# EAGLE design dcv moduler incomplete (EAGLE 9.6.2)
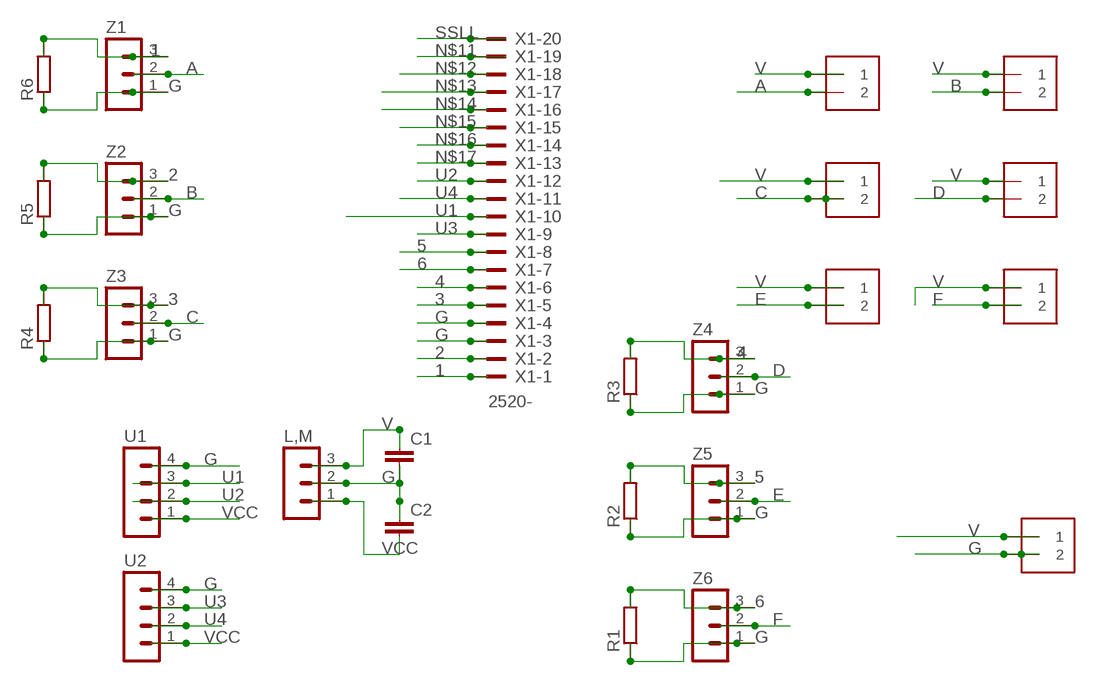
[diagram p0: schematic, sheet 1]

## Parts
C1  C2,5-3  [C2.5-3]
C2  C2,5-3  [C2.5-3]
J1  1X2-3.5MM  [1X2-3.5MM]
J2  1X2-3.5MM  [1X2-3.5MM]
J3  1X2-3.5MM  [1X2-3.5MM]
J4  1X2-3.5MM  [1X2-3.5MM]
J5  1X2-3.5MM  [1X2-3.5MM]
J6  1X2-3.5MM  [1X2-3.5MM]
J7  1X2-3.5MM  [1X2-3.5MM]
L,M  MA03-1  [MA03-1]
R1  R-EU_0204_5  [0204/5]
R2  R-EU_0204_5  [0204/5]
R3  R-EU_0204_5  [0204/5]
R4  R-EU_0204_5  [0204/5]
R5  R-EU_0204_5  [0204/5]
R6  R-EU_0204_5  [0204/5]
U1  MA04-1  [MA04-1]
U2  MA04-1  [MA04-1]
X1  2520-  [PAK100/2500-20]
Z1  MA03-1  [MA03-1]
Z2  MA03-1  [MA03-1]
Z3  MA03-1  [MA03-1]
Z4  MA03-1  [MA03-1]
Z5  MA03-1  [MA03-1]
Z6  MA03-1  [MA03-1]

## Nets
1: R6.2 X1.1 Z1.3
2: R5.2 X1.2 Z2.3
3: R4.2 X1.5 Z3.3
4: R3.2 X1.6 Z4.3
5: R2.2 X1.8 Z5.3
6: R1.2 X1.7 Z6.3
A: J1.2 Z1.2
B: J2.2 Z2.2
C: J3.2 Z3.2
D: J4.2 Z4.2
E: J5.2 Z5.2
F: J6.2 Z6.2
G: C1.2 C2.1 J7.2 L,M.2 R1.1 R2.1 R3.1 R4.1 R5.1 R6.1 U1.4 U2.4 X1.3 X1.4 Z1.1 Z2.1 Z3.1 Z4.1 Z5.1 Z6.1
N$11: X1.19
N$12: X1.18
N$13: X1.17
N$14: X1.16
N$15: X1.15
N$16: X1.14
N$17: X1.13
SSLL: X1.20
U1: U1.3 X1.10
U2: U1.2 X1.12
U3: U2.3 X1.9
U4: U2.2 X1.11
V: C1.1 J1.1 J2.1 J3.1 J4.1 J5.1 J6.1 J7.1 L,M.3
VCC: C2.2 L,M.1 U1.1 U2.1

## Library data of the parts
C1 C2 = capacitor-wima:C: CAPACITOR naming: grid - package width
J1-J7 = adafruit:1X2: 3.5mm Terminal block http://www.ladyada.net/library/pcb/eaglelibrary.html
L,M Z1-Z6 = con-lstb:MA03-1: PIN HEADER; OC_FARNELL: unknown; OC_NEWARK: unknown
R1-R6 = resistor (2):R-EU_: RESISTOR, European symbol; SPICEPREFIX: R
U1 U2 = con-lstb:MA04-1: PIN HEADER; OC_FARNELL: unknown; OC_NEWARK: unknown
X1 = con-3m:2520-: 3M (TM) Pak 100 4-Wall Header Source: 3M; OC_FARNELL: unknown; OC_NEWARK: unknown

## Board
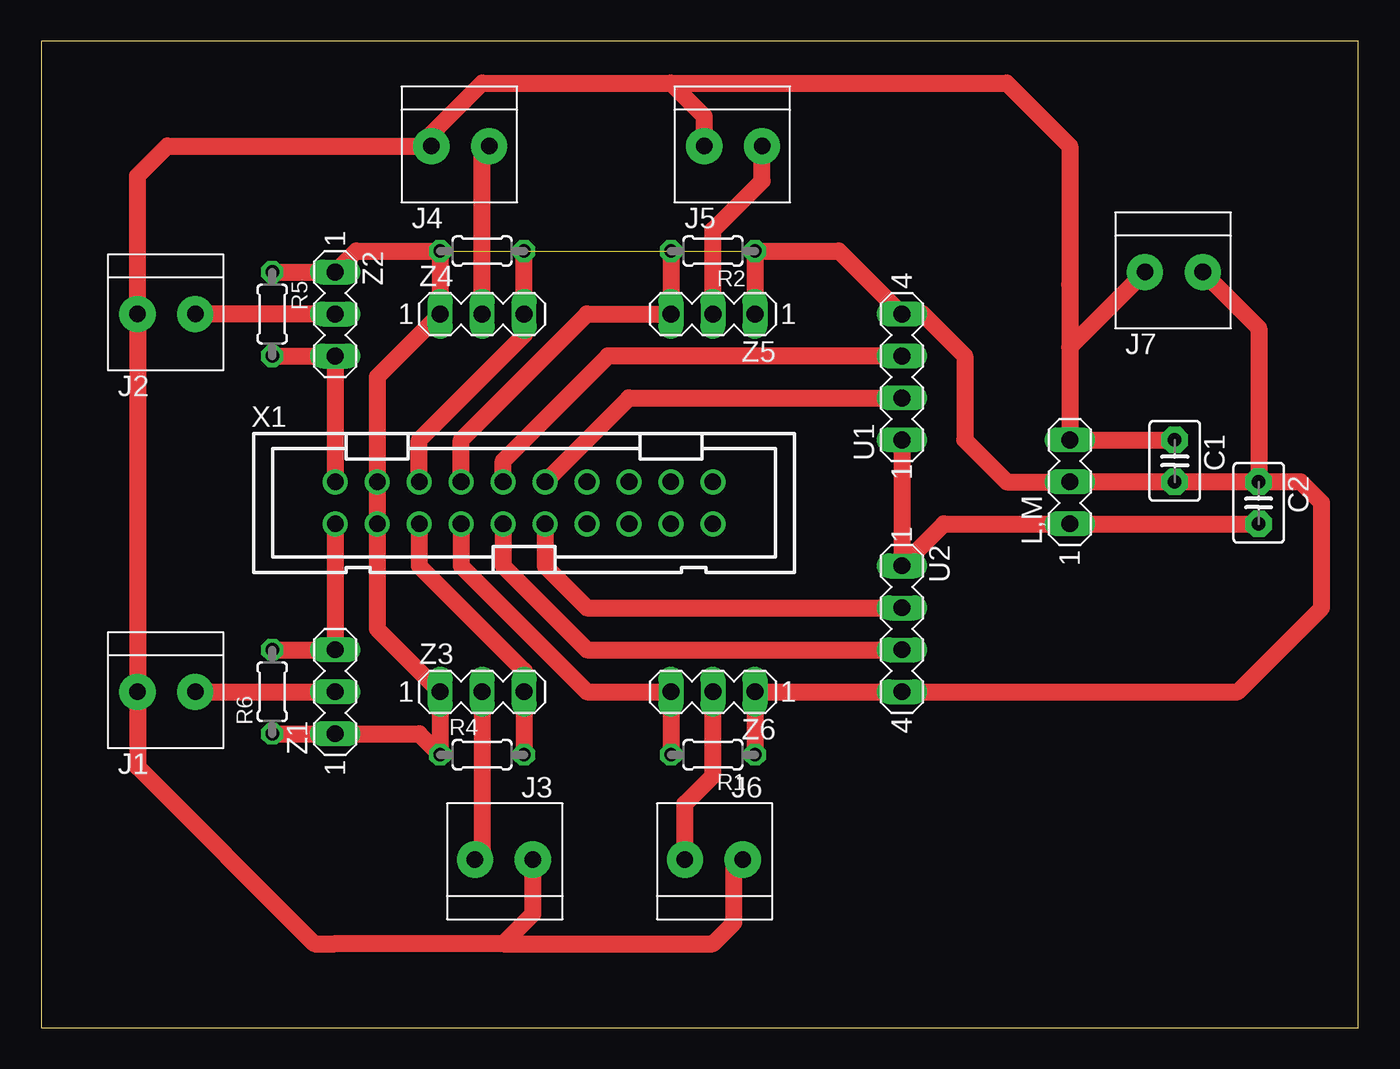
[diagram p1: board, top side]

Size 79.68 x 59.68 mm. Coordinates in mm from the lower left corner, seen from the top.
Outline: 0,0 79.68,0 79.68,59.68 0,59.68 0,0
Copper layers (1*16): Top 0.035mm / dielectric 1.5mm / Bottom 0.035mm
Design rules "default": minimum track width 6mil, minimum drill 0.35mm, track to track 6mil, track to pad 6mil, pad to pad 6mil, via to via 6mil, smd to smd 6mil, copper to edge 40mil, drill to drill 6mil, minimum pad ring 10mil, minimum via ring 8mil, stop-mask expansion 4mil, vias tented up to drill 0mil, thermal gap 10mil

### Footprints (pad centres in the part's own frame; a part is rotated, then mirrored left to right if it is on the bottom)
C2.5-3 = drill 0.813 pad 1.6 octagon: 1 -1.27,0; 2 1.27,0
1X2-3.5MM = drill 1 pad 2.184: 1 1.8,0; 2 -1.7,0
MA03-1 = drill 1.016 long: 1 -2.54,0; 2 0,0; 3 2.54,0
0204/5 = drill 0.813 octagon: 1 -2.54,0; 2 2.54,0
MA04-1 = drill 1.016 long: 1 -3.81,0; 2 -1.27,0; 3 1.27,0; 4 3.81,0
PAK100/2500-20 = drill 1 pad 1.422: 1 -11.43,-1.27; 2 -11.43,1.27; 3 -8.89,-1.27; 4 -8.89,1.27; 5 -6.35,-1.27; 6 -6.35,1.27; 7 -3.81,-1.27; 8 -3.81,1.27; 9 -1.27,-1.27; 10 -1.27,1.27; 11 1.27,-1.27; 12 1.27,1.27; 13 3.81,-1.27; 14 3.81,1.27; 15 6.35,-1.27; 16 6.35,1.27; 17 8.89,-1.27; 18 8.89,1.27; 19 11.43,-1.27; 20 11.43,1.27

### Placement (x,y rotation side)
C1  68.58,34.29 270 top
C2  73.66,31.75 270 top
J1  7.62,20.32 180 top
J2  7.62,43.18 180 top
J3  27.94,10.16 0 top
J4  25.4,53.34 180 top
J5  41.91,53.34 180 top
J6  40.64,10.16 0 top
J7  68.58,45.72 180 top
L,M  62.23,33.02 90 top
R1  40.64,16.51 180 top
R2  40.64,46.99 180 top
R3  26.67,46.99 0 top
R4  26.67,16.51 0 top
R5  13.97,43.18 270 top
R6  13.97,20.32 90 top
U1  52.07,39.37 90 top
U2  52.07,24.13 270 top
X1  29.21,31.75 0 top
Z1  17.78,20.32 90 top
Z2  17.78,43.18 270 top
Z3  26.67,20.32 0 top
Z4  26.67,43.18 0 top
Z5  40.64,43.18 180 top
Z6  40.64,20.32 180 top

### Tracks (layer width: path | path; a pad name or v marks a point on that pad's centre or on a via)
1
  Top 1.016: R6.2 Z1.3 X1.1
2
  Top 1.016: R5.2 Z2.3 X1.2
3
  Top 1.016: R4.2 Z3.3 29.21,21.59 22.86,27.94 X1.5
4
  Top 1.016: R3.2 Z4.3 29.21,41.91 22.86,35.56 X1.6
5
  Top 1.016: R2.2 Z5.3 33.02,43.18 25.4,35.56 X1.8
6
  Top 1.016: R1.2 Z6.3 33.02,20.32 25.4,27.94 X1.7
A
  Top 1.016: J1.2 Z1.2
B
  Top 1.016: Z2.2 J2.2
C
  Top 1.016: Z3.2 26.67,10.59 J3.2
D
  Top 1.016: Z4.2 26.67,52.91 J4.2
E
  Top 1.016: Z5.2 40.64,48.26 43.61,51.23 J5.2
F
  Top 1.016: J6.2 38.94,13.54 40.64,15.24 Z6.2
G  (1 unrouted)
  Top 1.016: Z5.1 R2.1 48.26,46.99 U1.4 53.34,43.18 55.88,40.64 55.88,35.56 58.42,33.02 L,M.2 C1.2 C2.1 | R1.1 Z6.1 U2.4 72.39,20.32 77.47,25.4 77.47,31.75 76.2,33.02 C2.1 | R6.1 Z1.1 22.86,17.78 R4.1 Z3.1 20.32,24.13 X1.3 X1.4 20.32,39.37 Z4.1 R3.1 19.05,46.99 Z2.1 R5.1 | J7.2 73.66,42.34 C2.1
U1
  Top 1.016: X1.10 27.94,34.29 34.29,40.64 U1.3
U2
  Top 1.016: X1.12 35.56,38.1 U1.2
U3
  Top 1.016: X1.9 27.94,27.94 33.02,22.86 U2.3
U4
  Top 1.016: X1.11 30.48,27.94 33.02,25.4 U2.2
V
  Top 1.016: C1.1 L,M.3 62.23,41.17 | J7.1 62.23,41.17 | 27.94,5.08 29.74,6.88 J3.1 | 27.94,5.08 17.78,5.08 16.51,5.08 5.82,15.77 J1.1 J2.1 5.82,51.54 7.62,53.34 J4.1 23.6,54.08 26.67,57.15 38.1,57.15 | 27.94,5.08 40.64,5.08 41.91,6.35 41.91,9.63 J6.1 | J5.1 40.11,55.14 38.1,57.15 | 38.1,57.15 58.42,57.15 62.23,53.34 62.23,44.98 62.23,41.17
VCC
  Top 1.016: C2.2 L,M.1 54.61,30.48 U2.1 U1.1